# Altium schematic sheet 10_ADC.SchDoc
size 420 x 297 mm; SheetNumber: 10; SheetTotal: 12
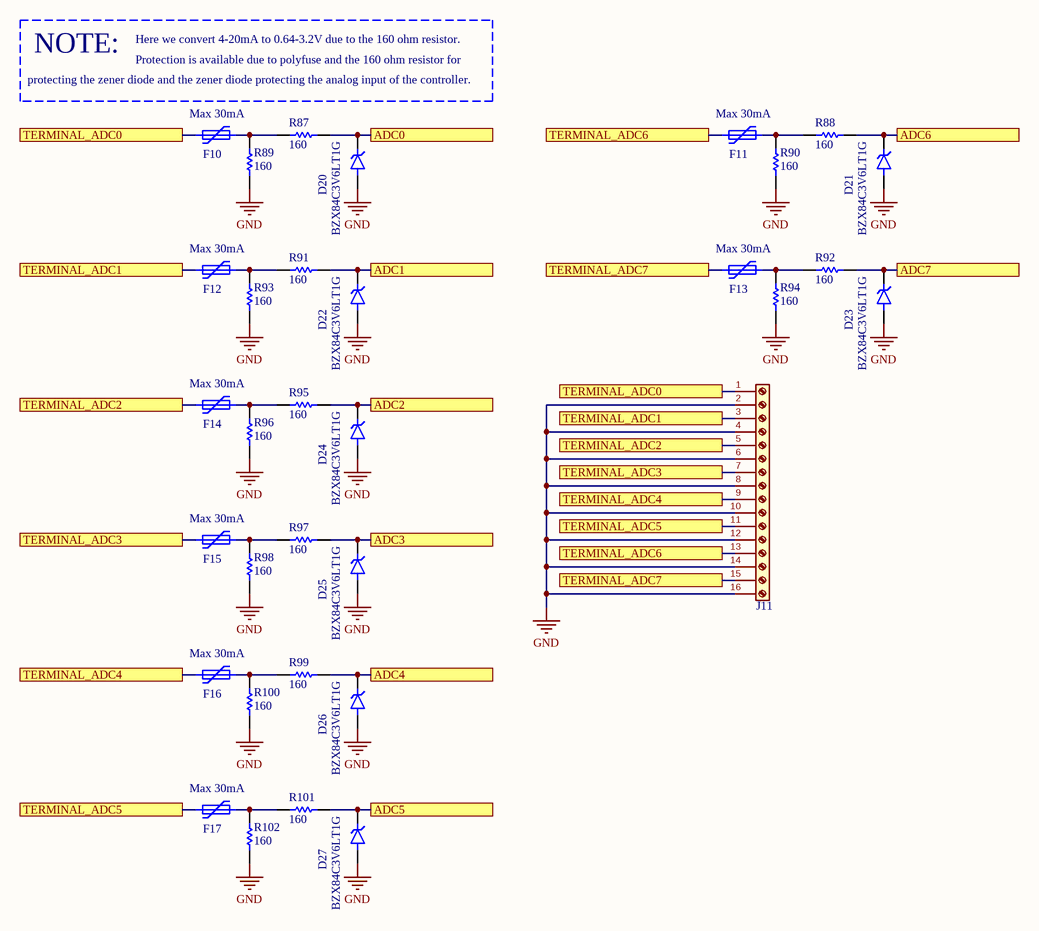
[diagram p0: 10_ADC.SchDoc]

## Parts
D20  BZX84C3V6LT1G  [SOT95P240X111-3N]
D21  BZX84C3V6LT1G  [SOT95P240X111-3N]
D22  BZX84C3V6LT1G  [SOT95P240X111-3N]
D23  BZX84C3V6LT1G  [SOT95P240X111-3N]
D24  BZX84C3V6LT1G  [SOT95P240X111-3N]
D25  BZX84C3V6LT1G  [SOT95P240X111-3N]
D26  BZX84C3V6LT1G  [SOT95P240X111-3N]
D27  BZX84C3V6LT1G  [SOT95P240X111-3N]
F10  Max 30mA  [Fuse_0603_1608Metric]
F11  Max 30mA  [Fuse_0603_1608Metric]
F12  Max 30mA  [Fuse_0603_1608Metric]
F13  Max 30mA  [Fuse_0603_1608Metric]
F14  Max 30mA  [Fuse_0603_1608Metric]
F15  Max 30mA  [Fuse_0603_1608Metric]
F16  Max 30mA  [Fuse_0603_1608Metric]
F17  Max 30mA  [Fuse_0603_1608Metric]
J11  Terminal_01x16_P5.00  [TerminalBlock_Phoenix_PT-1,5-16-5.0-H_1x16_P5.00mm_Horizontal]  (value not drawn)
R87  ValueDisplayed: 160  [0603]  (hidden comment: CRCW060320R0JNEA)
R88  ValueDisplayed: 160  [0603]  (hidden comment: CRCW060320R0JNEA)
R89  ValueDisplayed: 160  [0603]  (hidden comment: CRCW060320R0JNEA)
R90  ValueDisplayed: 160  [0603]  (hidden comment: CRCW060320R0JNEA)
R91  ValueDisplayed: 160  [0603]  (hidden comment: CRCW060320R0JNEA)
R92  ValueDisplayed: 160  [0603]  (hidden comment: CRCW060320R0JNEA)
R93  ValueDisplayed: 160  [0603]  (hidden comment: CRCW060320R0JNEA)
R94  ValueDisplayed: 160  [0603]  (hidden comment: CRCW060320R0JNEA)
R95  ValueDisplayed: 160  [0603]  (hidden comment: CRCW060320R0JNEA)
R96  ValueDisplayed: 160  [0603]  (hidden comment: CRCW060320R0JNEA)
R97  ValueDisplayed: 160  [0603]  (hidden comment: CRCW060320R0JNEA)
R98  ValueDisplayed: 160  [0603]  (hidden comment: CRCW060320R0JNEA)
R99  ValueDisplayed: 160  [0603]  (hidden comment: CRCW060320R0JNEA)
R100  ValueDisplayed: 160  [0603]  (hidden comment: CRCW060320R0JNEA)
R101  ValueDisplayed: 160  [0603]  (hidden comment: CRCW060320R0JNEA)
R102  ValueDisplayed: 160  [0603]  (hidden comment: CRCW060320R0JNEA)

## Ports
ADC0 (see 04_STM32F303VCT6[3B]), ADC1 (see 04_STM32F303VCT6[3B]), ADC2 (see 04_STM32F303VCT6[3B]), ADC3 (see 04_STM32F303VCT6[2B]), ADC4 (see 04_STM32F303VCT6[2B]), ADC5 (see 04_STM32F303VCT6[2B]), ADC6 (see 04_STM32F303VCT6[2B]), ADC7 (see 04_STM32F303VCT6[2B]), TERMINAL_ADC0 (see 10_ADC[1A]), TERMINAL_ADC0 (see 10_ADC[2B]), TERMINAL_ADC1 (see 10_ADC[1A]), TERMINAL_ADC1 (see 10_ADC[2B]), TERMINAL_ADC2 (see 10_ADC[1B]), TERMINAL_ADC2 (see 10_ADC[2B]), TERMINAL_ADC3 (see 10_ADC[1B]), TERMINAL_ADC3 (see 10_ADC[2B]), TERMINAL_ADC4 (see 10_ADC[1B]), TERMINAL_ADC4 (see 10_ADC[2B]), TERMINAL_ADC5 (see 10_ADC[1C]), TERMINAL_ADC5 (see 10_ADC[2B]), TERMINAL_ADC6 (see 10_ADC[2A]), TERMINAL_ADC6 (see 10_ADC[2B]), TERMINAL_ADC7 (see 10_ADC[2A]), TERMINAL_ADC7 (see 10_ADC[2B])

## Nets
GND: D20.1(A) D21.1(A) D22.1(A) D23.1(A) D24.1(A) D25.1(A) D26.1(A) D27.1(A) J11.2(Pin_2) J11.4(Pin_4) J11.6(Pin_6) J11.8(Pin_8) J11.10(Pin_10) J11.12(Pin_12) J11.14(Pin_14) J11.16(Pin_16) R89.1 R90.1 R93.1 R94.1 R96.1 R98.1 R100.1 R102.1
ADC0: D20.3(K) R87.2 ; port ADC0
ADC1: D22.3(K) R91.2 ; port ADC1
ADC2: D24.3(K) R95.2 ; port ADC2
ADC3: D25.3(K) R97.2 ; port ADC3
ADC4: D26.3(K) R99.2 ; port ADC4
ADC5: D27.3(K) R101.2 ; port ADC5
ADC6: D21.3(K) R88.2 ; port ADC6
ADC7: D23.3(K) R92.2 ; port ADC7
TERMINAL_ADC0: F10.1 J11.1(Pin_1) ; port TERMINAL_ADC0
TERMINAL_ADC1: F12.1 J11.3(Pin_3) ; port TERMINAL_ADC1
TERMINAL_ADC2: F14.1 J11.5(Pin_5) ; port TERMINAL_ADC2
TERMINAL_ADC3: F15.1 J11.7(Pin_7) ; port TERMINAL_ADC3
TERMINAL_ADC4: F16.1 J11.9(Pin_9) ; port TERMINAL_ADC4
TERMINAL_ADC5: F17.1 J11.11(Pin_11) ; port TERMINAL_ADC5
TERMINAL_ADC6: F11.1 J11.13(Pin_13) ; port TERMINAL_ADC6
TERMINAL_ADC7: F13.1 J11.15(Pin_15) ; port TERMINAL_ADC7
NetF10_2: F10.2 R87.1 R89.2
NetF11_2: F11.2 R88.1 R90.2
NetF12_2: F12.2 R91.1 R93.2
NetF13_2: F13.2 R92.1 R94.2
NetF14_2: F14.2 R95.1 R96.2
NetF15_2: F15.2 R97.1 R98.2
NetF16_2: F16.2 R99.1 R100.2
NetF17_2: F17.2 R101.1 R102.2

## Notes on the sheet
- protecting the zener diode and the zener diode protecting the analog input of the controller.
- NOTE:
- Here we convert 4-20mA to 0.64-3.2V due to the 160 ohm resistor.
- Protection is available due to polyfuse and the 160 ohm resistor for
- Sub-system:
- Project:
- Design by:
- Sheet title:
- Sheet
- of
- Checked by:
- Approved by:
- Doc No:
- Revision:
- Size:
- Date:
- A3

## Library data of the parts
D20-D27 = BZX84C3V6LT1G: MP: BZX84C10LT1G; Package: None; Price: None; Value: *; Availability: Unavailable
F10-F17 = Polyfuse 0603
R87-R102 = RES 160R 0603: RES, 160, 5%, 0.1 W, AEC-Q200 Grade 0, 0603; Manufacturer: Vishay-Dale; Power_W: 100mW; TempCo: 200 ppm/C; Value_Code: 20R0; Value: 20; EIA_Code: E24; SizeX_mm: 1.6; SizeY_mm: 0.8; SizeZ_mm: 1; Value2: 0.1W; SizeArea_mm2: 1.28; CompType: Resistor; AEC Qualified: Y; VDC_V: 75V; AEC Category: Q200; AEC Grade: 0; Supplier Part Number 2: 59M6784; Supplier 2: Newark; Supplier Part Number 3: 71-CRCW0603J-20-E3; Supplier 3: Mouser; RoHS: E; Value1: 5%; MountType: SMT; Supplier 1: Digi-Key; PackageReference: 0603; Tolerance_%: 5%; Res_ohm: 20; PartNumber: CRCW060320R0JNEA; ComponentLink1Description: Datasheet link; Supplier Part Number 1: 541-20GCT-ND; Technology: Thick Film; ComponentLink1URL: http://www.vishay.com/docs/20035/dcrcwe3.pdf